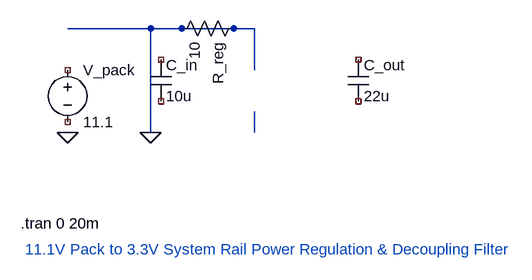
[diagram p0: schematic power_regulator_3v3.asc]
power_regulator_3v3.asc, the LTspice schematic file:
Version 4
SHEET 1 880 680
WIRE 0 0 -128 0
WIRE 160 0 0 0
WIRE 160 64 160 0
WIRE 160 160 160 128
WIRE 0 160 0 0
FLAG 0 160 0
FLAG -128 160 0
SYMBOL voltage -128 48 R0
SYMATTR InstName V_pack
SYMATTR Value 11.1
SYMBOL cap 0 48 R0
SYMATTR InstName C_in
SYMATTR Value 10u
SYMBOL res 144 -16 R90
SYMATTR InstName R_reg
SYMATTR Value 10
SYMBOL cap 304 48 R0
SYMATTR InstName C_out
SYMATTR Value 22u
TEXT -200 300 Left 2 !.tran 0 20m
TEXT -200 340 Left 2 ; 11.1V Pack to 3.3V System Rail Power Regulation & Decoupling Filter

The netlist it stands for:
* power_regulator_3v3.asc
V_pack NC_01 NC_02 11.1
C_in NC_03 NC_04 10u
R_reg 0 0 10
C_out NC_05 NC_06 22u
.tran 0 20m
*  11.1V Pack to 3.3V System Rail Power Regulation & Decoupling Filter
.backanno
.end